# Altium schematic sheet 5V_regulators.SchDoc
size B; SheetNumber: 4; SheetTotal: 4
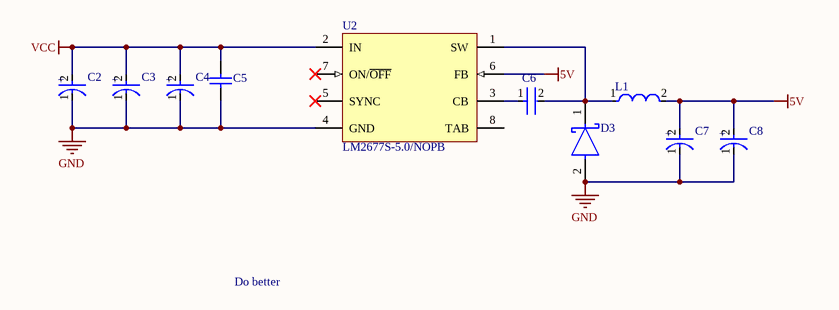
[diagram p0: 5V_regulators.SchDoc]

## Parts
C2  16TQC15M  [FP-POSCAP-B2-MFG]  (value not drawn)
C3  16TQC15M  [FP-POSCAP-B2-MFG]  (value not drawn)
C4  16TQC15M  [FP-POSCAP-B2-MFG]  (value not drawn)
C5  CAP 470nF 50V 1812(4532)  [CAPC1812(4532)125_M]  (value not drawn)
C6  C0805C103J5RACTU  [FP-C0805C-DN-MFG]  (value not drawn)
C7  25SVPF180M  [FP-OS-CON-SMT-E12-MFG]  (value not drawn)
C8  25SVPF180M  [FP-OS-CON-SMT-E12-MFG]  (value not drawn)
D3  B540C-13-F  [FP-SMC-MFG]  (value not drawn)
L1  SRP6060FA-220M  [FP-SRP6060FA-MFG]  (value not drawn)
U2  LM2677S-5.0/NOPB  [KTW0007B_N]

## Nets
5V: C7.2(A) C8.2(A) L1.2 U2.6(FB)
GND: C2.1(C) C3.1(C) C4.1(C) C5.1 C7.1(C) C8.1(C) D3.2(A) U2.4(GND)
VCC: C2.2(A) C3.2(A) C4.2(A) C5.2 U2.2(IN)
NetC6_1: C6.1 U2.3(CB)
NetC6_2: C6.2 D3.1(C) L1.1 U2.1(SW)

Not connected (* = marked no-connect by the designer): U2 5(SYNC)* 7(ON/~{OFF})* 8(TAB)

## Notes on the sheet
- Do better
- (in symbol CMP-05428-001075-1) +
- (in symbol CMP-05428-001076-1) +

## Library data of the parts
C2-C4 = CMP-05428-001076-1: Molded Tantalum Polymer Capacitor 15uF 20% 16V life 2000Hours SMD 1411; Dissipation Factor: 10%; Ripple Current: 1A; Leakage Current: 72uA; ESR (Equivalent Series Resistance): 90mR; Polarity: Polar; Height: 1.9mm; Height - Seated (Max): 0.079inch; Min Operating Temperature: -55°C; Case Code (Imperial): 1210; Package Quantity: 2000; Mount: Surface Mount; RoHS Compliant: Yes; Voltage Rating: 16V; Packaging: Tape and Reel; Number of Pins: 2; Features: General Purpose; Depth: 2.8mm; Case/Package: 1411; Case Code (Metric): 3528; Length: 3.5mm; Termination: SMD/SMT; Lead Free: Lead Free; Life (Hours): 2000Hour; Series: POSCAP™ TQC; Radiation Hardening: No; Voltage Rating (DC): 16V; Voltage: 16V; Capacitance: 15uF; REACH SVHC: No SVHC; Construction: Flat; Tolerance: 20%; Width: 2.8mm; Max Operating Temperature: 105°C
C5 = CMP-1040-01539-1: CAP 470nF 50V ±10% 1812 (4532 Metric) Thickness 1.25mm SMD; Tolerance: Â±10%; Case-Metric: 4532; Case-EIA: 1812; Technology: SMT; Max Thickness: 1.25 mm; Value: 470nF; Rated Voltage: 50 V
C6 = CMP-2007-00254-2: CAP CER 10000PF 50V X7R 0805; Manufacturer: KEMET; Value: 10,000 pF; Material: Ceramic; Temperature Coefficient: 30ppm/°C; Tolerance: 0.05; Device Class L1: Passive Components; Temperature: -55°C to +125°C; Lead Free: Yes; ComponentLink2URL: https://content.kemet.com/datasheets/KEM_C1003_C0G_SMD.pdf; Device Class L3: Ceramic Capacitors; Temperature Characteristic: X7R; Temperature Range High: +125°C; Mouser Description: Capacitor; Ceramic; Cap 0.01uF; Tol 5%; Vol-Rtg 50 V; SMT; Case 0805; X7R; TR; ComponentLink2Description: Datasheet; Manufacturer Part Number: C0805C103J5RACTU; Height: 0.88mm; Digikey Description: CAP CER 10000PF 50V X7R 0805; Capacitance: 10,000 pF; Temperature Range Low: -55°C; Device Class L2: Capacitors; Octopart: https://octopart.com/c0805c103j5ractu-kemet-133473; Voltage Rating: 50 V; Category: Cap; RoHS: TRUE; Automotive: No; Package: C0805C-DN; Ipc Land Pattern Name: CAPC200125X78
C7 C8 = CMP-05428-001075-1: Conductive Polymer Aluminum Solid Capacitors (OS-CON) 180uF ±20% 25V; Polarity: Polar; Ripple Current (AC): 4.65A; Dissipation Factor: 12%; ESR (Equivalent Series Resistance): 16mR; Life (Hours): 5000Hour; Leakage Current: 900uA; Voltage Rating (DC): 25V; Height: 11.9mm; REACH SVHC: No SVHC; Number of Pins: 12; Series: OS-CON™, SVPF; Length: 11.9mm; Packaging: Tape and Reel; Case/Package: Radial; Diameter: 8mm; Voltage: 25V; Lead Free: Lead Free; Height - Seated (Max): 0.472inch; Ripple Current: 4.65A; Package Quantity: 400; Tolerance: 20%; Max Operating Temperature: 105°C; RoHS Compliant: Yes; Mount: Surface Mount; Termination: SMD/SMT; Voltage Rating: 25V; Capacitance: 180uF; Min Operating Temperature: -55°C
D3 = CMP-2000-05097-3: DIODE SCHOTTKY 40V 5A SMC; Manufacturer: Diodes Inc.; Automotive Grade: NA; Peak Reverse Current: 0.5mA; Value: 300pF; Max Junction Temp: +150°C; Max Surge Forward Current: 100A; Standoff Height: 0.1mm; Digikey Description: DIODE SCHOTTKY 40V 5A SMC; Temperature Range Low: -55°C; Manufacturer Part Number: B540C-13-F; Octopart: https://octopart.com/b540c-13-f-diodes+inc.-325873; Lead Free: Yes; Reverse Voltage: 40V; RoHS: TRUE; Category: Diode; Mouser Description: Diode: Schottky rectifying; SMD; 40V; 5A; SMC; Package: reel, tape; ComponentLink2Description: Datasheet; Temperature Range High: +150°C; Automotive: No; Footprint Url: https://www.diodes.com/assets/Package-Files/SMC.pdf; Device Class L3: Schottky Diodes; Height: 2.5mm; Forward Current: 5A; Temperature: -55°C to +150°C; Package: SMC; ComponentLink2URL: https://www.diodes.com/assets/Datasheets/ds13012.pdf; Device Class L2: Diodes; Max Repetitive Reverse Voltage: 40V; Device Class L1: Discrete Semiconductors; Capacitance: 300pF
L1 = CMP-07248-000025-2: IND,6.6X6.4X5.8MM,22UH,20%,5A,SH; Self Resonant Frequency: 10MHz; Shielding: Shielded; Test Frequency: 100kHz; DC Resistance (DCR): 60.5mR; Core Material: Ferrite; Saturation Current: 5.6A; Current Rating: 5A; Composition: Wirewound; Inductance: 22uH; Min Operating Temperature: -55°C; Tolerance: 20%; Packaging: Tape and Reel; Ratings: AEC-Q200; Case/Package: Nonstandard; Mount: Surface Mount; Max Operating Temperature: 155°C
U2 = CMP-0069-00212-3: SIMPLE SWITCHER® High Efficiency 5A Step-Down Voltage Regulator with Sync, 7-pin TO-263, Pb-Free; Manufacturer: Texas Instruments; PackageTopMarking: NSUZXYTTE#*LM2677S*-5.0; PowerWise: N; Code_JEDEC: MO-169-AC; ComponentLink1URL: http://www.ti.com/general/docs/lit/getliterature.tsp?genericPartNumber=LM2677&fileType=pdf; PackageReference: KTW0007B; PinCount: 7; RoHS: Y; PackageDescription: TO-263, Molded, .400 x .390 x .180in Body, 7 Lead, .050in Pitch, Surface Mount; ComponentLink1Description: Datasheet URL; CompType: Switcher